# Altium project DE-150824.PrjPcb
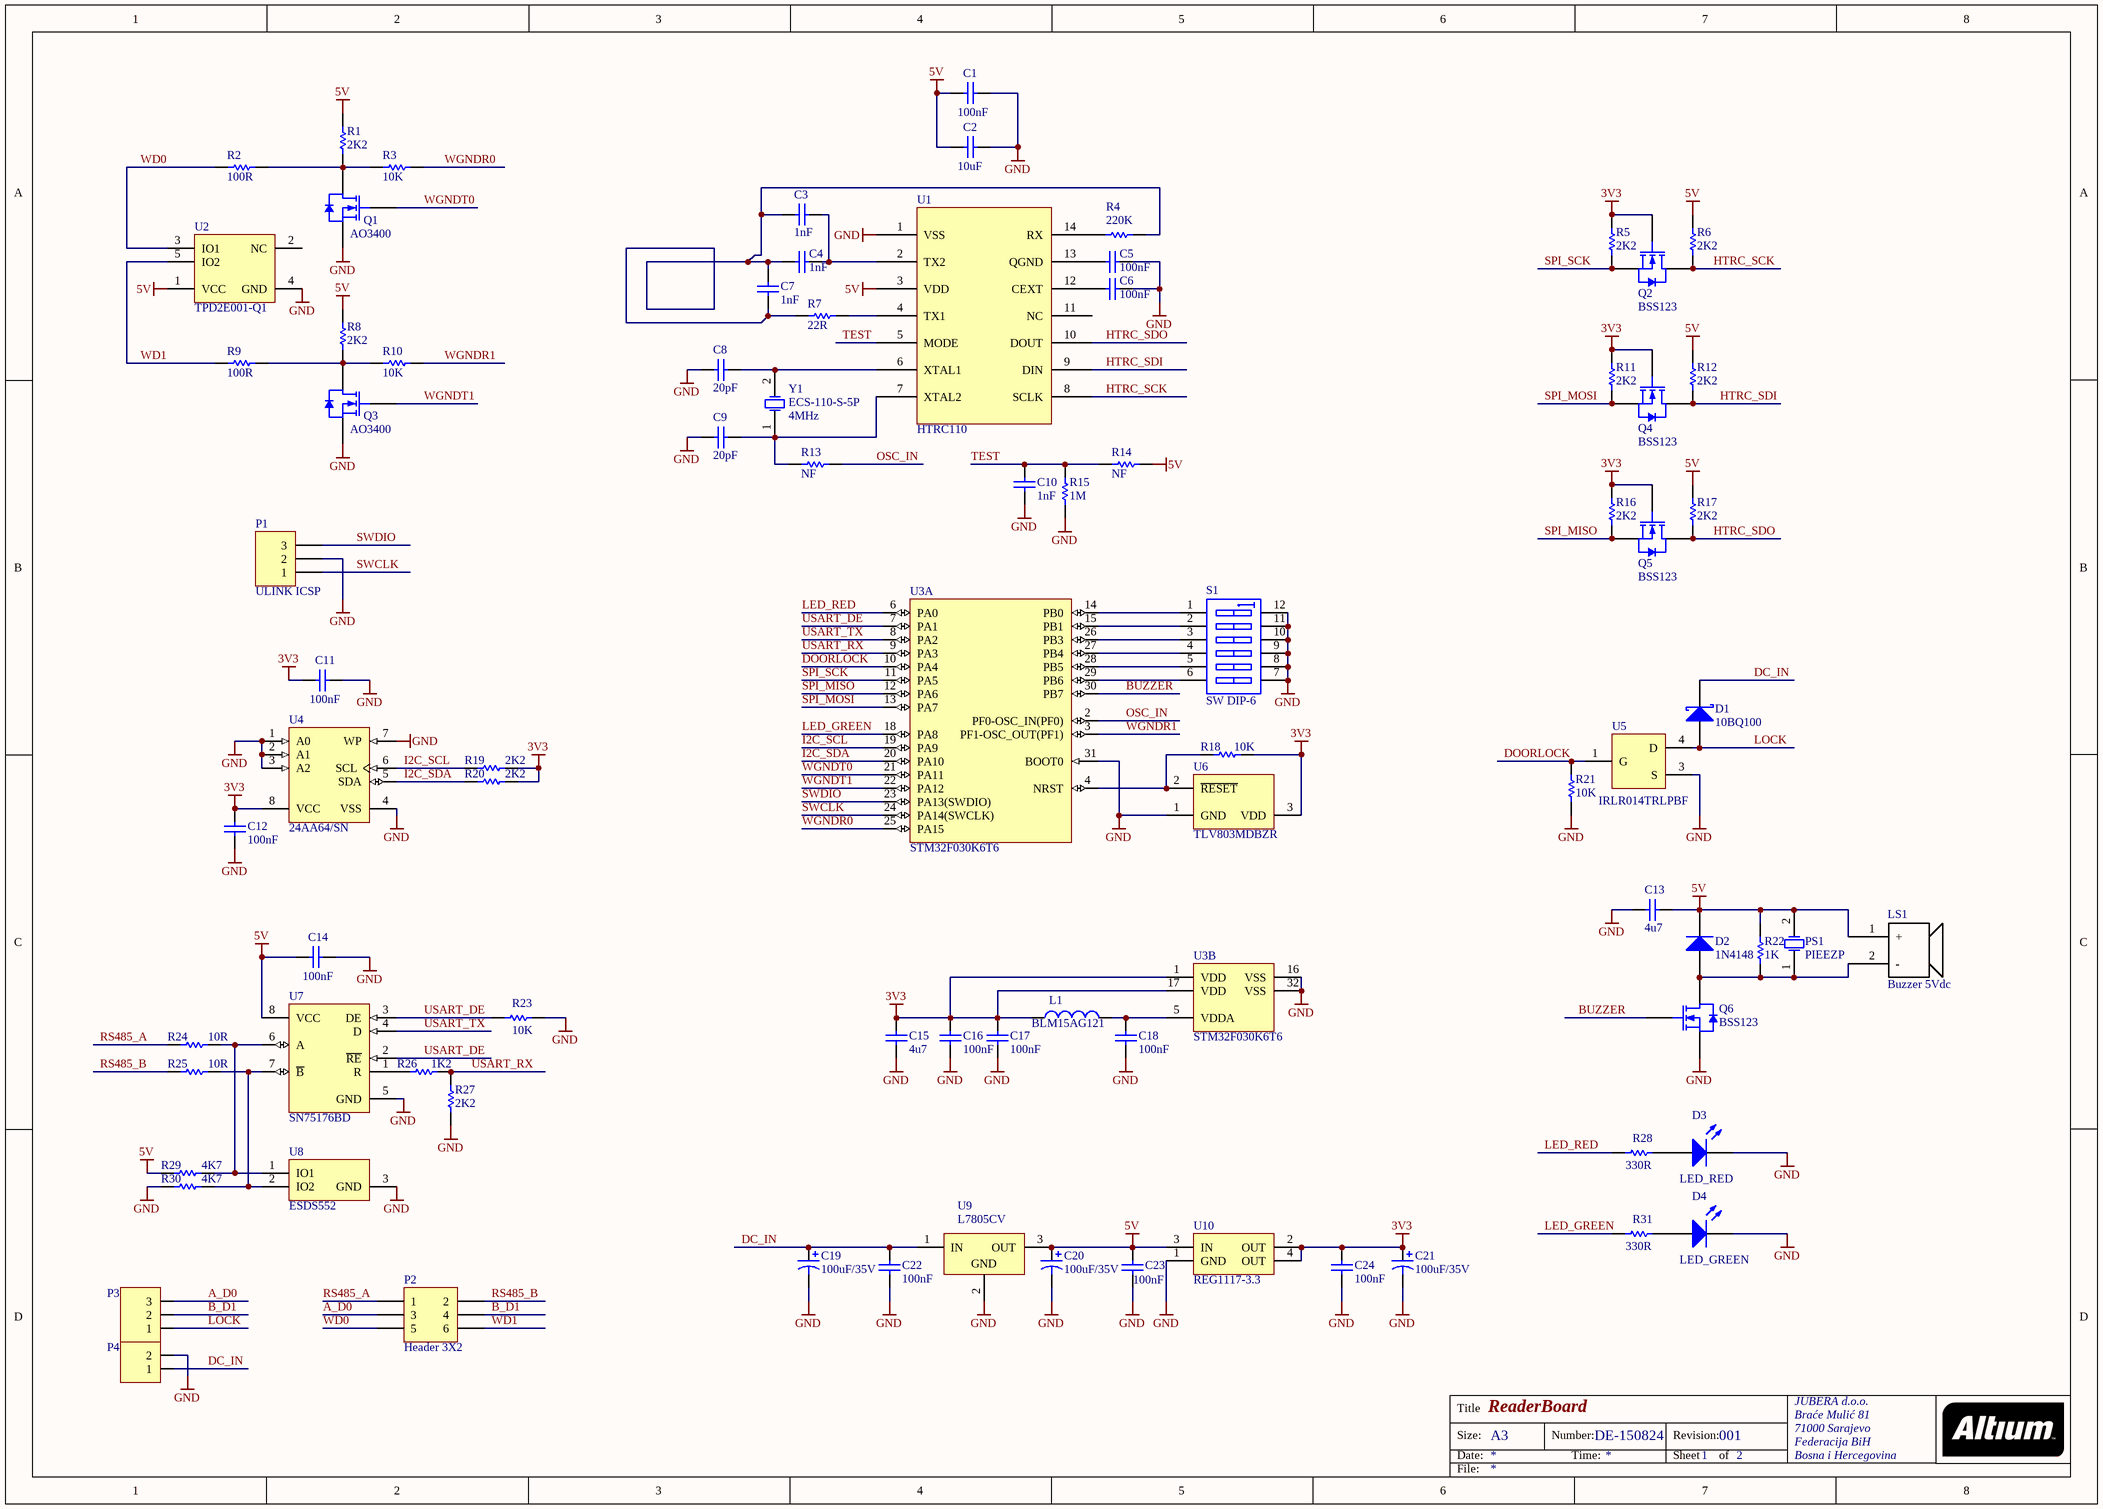
[diagram p0: DE-150824.SchDoc]
1 sheet, 84 parts. Net scope: global (net labels, ports and power ports of the same name join across sheets).
Board file: DE-150824.PcbDoc

## Sheet DE-150824.SchDoc: ReaderBoard
size A3; Author: eldar6776@hotmail.com; DrawnBy: Eldar Dedic; Organization: JUBERA d.o.o.; Address1: Braće Mulić 81; Address2: 71000 Sarajevo; Address3: Federacija BiH; Address4: Bosna i Hercegovina; DocumentNumber: DE-150824; Revision: 001; SheetNumber: 1; SheetTotal: 2

### Parts
C1  value 100nF  [0603]  (hidden comment: C0603)
C2  value 10uF  [0805]  (hidden comment: C0805)
C3  1nF  [VP31-2.5]
C4  value 1nF  [0805]  (hidden comment: C0805)
C5  value 100nF  [0603]  (hidden comment: C0603)
C6  value 100nF  [0603]  (hidden comment: C0603)
C7  value 1nF  [0805]  (hidden comment: C0805)
C8  20pF  [0603]
C9  20pF  [0603]
C10  value 1nF  [0603]  (hidden comment: C0603)
C11  value 100nF  [0603]  (hidden comment: C0603)
C12  value 100nF  [0603]  (hidden comment: C0603)
C13  value 4u7  [0805]  (hidden comment: C0805)
C14  value 100nF  [0603]  (hidden comment: C0603)
C15  value 4u7  [0805]  (hidden comment: C0805)
C16  value 100nF  [0603]  (hidden comment: C0603)
C17  value 100nF  [0603]  (hidden comment: C0603)
C18  value 100nF  [0603]  (hidden comment: C0603)
C19  100uF/35V  [F]
C20  100uF/35V  [F]
C21  100uF/35V  [F]
C22  value 100nF  [0603]  (hidden comment: C0603)
C23  value 100nF  [0603]  (hidden comment: C0603)
C24  value 100nF  [0603]  (hidden comment: C0603)
D1  10BQ100  [SMB]
D2  1N4148  [SOD323]
D3  LED_RED  [1.6X0.8X0.8]
D4  LED_GREEN  [1.6X0.8X0.8]
L1  BLM15AG121  [0402-A]
LS1  Buzzer 5Vdc  [BUZZER]
P1  ULINK ICSP  [HDR1X3]
P2  Header 3X2  [HDR2X3]
P3  3 pin terminal  [3 PIN TERMINAL BLOCK  3,5mm]  (value not drawn)
P4  2 pin terminal  [2 PIN TERMINAL BLOCK 3,5mm]  (value not drawn)
PS1  PIEEZP  [PKM13EPYH4000-A0]
Q1  AO3400  [SOT23_N]
Q2  BSS123  [SOT23_N]
Q3  AO3400  [SOT23_N]
Q4  BSS123  [SOT23_N]
Q5  BSS123  [SOT23_N]
Q6  BSS123  [SOT23_N]
R1  2K2  [ERA-0805]
R2  100R  [ERA-0805]
R3  10K  [ERA-0805]
R4  220K  [ERA-0805]
R5  2K2  [ERA-0603]
R6  2K2  [ERA-0603]
R7  22R  [ERA-0805]
R8  2K2  [ERA-0805]
R9  100R  [ERA-0805]
R10  10K  [ERA-0805]
R11  2K2  [ERA-0603]
R12  2K2  [ERA-0603]
R13  NF  [ERA-0805]
R14  NF  [ERA-0805]
R15  1M  [ERA-0805]
R16  2K2  [ERA-0603]
R17  2K2  [ERA-0603]
R18  10K  [ERA-0603]
R19  2K2  [ERA-0603]
R20  2K2  [ERA-0603]
R21  10K  [ERA-0603]
R22  1K  [ERA-0603]
R23  10K  [ERA-0603]
R24  10R  [ERA-0805]
R25  10R  [ERA-0805]
R26  1K2  [ERA-0603]
R27  2K2  [ERA-0603]
R28  330R  [ERA-0603]
R29  4K7  [ERA-0603]
R30  4K7  [ERA-0603]
R31  330R  [ERA-0603]
S1  SW DIP-6  [DIP-12/SW]
U1  HTRC110  [SOIC-SL14_N]
U2  TPD2E001-Q1  [DRL5_V]
U3  STM32F030K6T6  [STM-LQFP32_N]  (parts A,B of 2)
U4  24AA64/SN  [SOIC-SN8_N]
U5  IRLR014TRLPBF  [ONSC-DPAK-3-369C-01_V]
U6  TLV803MDBZR  [DBZ3_N]
U7  SN75176BD  [D008_N]
U8  ESDS552  [DCK3_N]
U9  L7805CV  [TO220]
U10  REG1117-3.3  [ZZ311]
Y1  ECS-110-S-5P  value 4MHz  [CSM-7]

### Nets
3V3: C11.2 C12.2 C15.2 C16.2 C17.2 C21.1 C24.2 L1.1 Q2.1(G) Q4.1(G) Q5.1(G) R5.2 R11.2 R16.2 R18.1 R19.2 R20.2 U3.1(VDD) U3.17(VDD) U4.8(VCC) U6.3(VDD) U10.2(OUT) U10.4(OUT)
5V: C1.2 C2.2 C13.1 C14.2 C20.1 C23.2 D2.1(K) LS1.1(+) PS1.2(OSC2) R1.2 R6.2 R8.2 R12.2 R14.2 R17.2 R22.1 R29.1 U1.3(VDD) U2.1(VCC) U7.8(VCC) U9.3(OUT) U10.3(IN)
GND: C1.1 C2.1 C5.1 C6.1 C8.1 C9.1 C10.2 C11.1 C12.1 C13.2 C14.1 C15.1 C16.1 C17.1 C18.1 C19.2 C20.2 C21.2 C22.1 C23.1 C24.1 D3.2(K) D4.2(K) P1.2 P4.2 Q1.2(S) Q3.2(S) Q6.2(S) R15.1 R21.2 R23.2 R27.1 R30.1 S1.7(B6) S1.8(B5) S1.9(B4) S1.10(B3) S1.11(B2) S1.12(B1) U1.1(VSS) U2.4(GND) U3.16(VSS) U3.31(BOOT0) U3.32(VSS) U4.1(A0) U4.2(A1) U4.3(A2) U4.4(VSS) U4.7(WP) U5.3(S) U6.1(GND) U7.5(GND) U8.3(GND) U9.2(GND) U10.1(GND)
A_D0: P2.3 P3.3
B_D1: P2.4 P3.2
BUZZER: Q6.1(G) U3.30(PB7)
DC_IN: C19.1 C22.2 D1.2(K) P4.1 U9.1(IN)
DOORLOCK: R21.1 U3.10(PA4) U5.1(G)
HTRC_SCK: Q2.3(D) R6.1 U1.8(SCLK)
HTRC_SDI: Q4.3(D) R12.1 U1.9(DIN)
HTRC_SDO: Q5.3(D) R17.1 U1.10(DOUT)
I2C_SCL: R19.1 U3.19(PA9) U4.6(SCL)
I2C_SDA: R20.1 U3.20(PA10) U4.5(SDA)
LED_GREEN: R31.1 U3.18(PA8)
LED_RED: R28.1 U3.6(PA0)
LOCK: D1.1(A) P3.1 U5.4(D)
OSC_IN: R13.2 U3.2(PF0-OSC_IN(PF0))
RS485_A: P2.1 R24.1
RS485_B: P2.2 R25.1
SPI_MISO: Q5.2(S) R16.1 U3.12(PA6)
SPI_MOSI: Q4.2(S) R11.1 U3.13(PA7)
SPI_SCK: Q2.2(S) R5.1 U3.11(PA5)
SWCLK: P1.1 U3.24(PA14(SWCLK))
SWDIO: P1.3 U3.23(PA13(SWDIO))
TEST: C10.1 R14.1 R15.2 U1.5(MODE)
USART_DE: R23.1 U3.7(PA1) U7.2(~{RE}) U7.3(DE)
USART_RX: R26.2 R27.2 U3.9(PA3)
USART_TX: U3.8(PA2) U7.4(D)
WD0: P2.5 R2.2 U2.3(IO1)
WD1: P2.6 R9.2 U2.5(IO2)
WGNDR0: R3.1 U3.25(PA15)
WGNDR1: R10.1 U3.3(PF1-OSC_OUT(PF1))
WGNDT0: Q1.1(G) U3.21(PA11)
WGNDT1: Q3.1(G) U3.22(PA12)
NetC3_1: C3.1 C4.2 C7.1 C7.2 R4.2 R7.1
NetC3_2: C3.2 C4.1 U1.2(TX2)
NetC5_2: C5.2 U1.13(QGND)
NetC6_2: C6.2 U1.12(CEXT)
NetC8_2: C8.2 U1.6(XTAL1) Y1.2(OSC2)
NetC9_2: C9.2 R13.1 U1.7(XTAL2) Y1.1(OSC1)
NetC18_2: C18.2 L1.2 U3.5(VDDA)
NetD2_2: D2.2(A) LS1.2(-) PS1.1(OSC1) Q6.3(D) R22.2
NetD3_1: D3.1(A) R28.2
NetD4_1: D4.1(A) R31.2
NetQ1_3: Q1.3(D) R1.1 R2.1 R3.2
NetQ3_3: Q3.3(D) R8.1 R9.1 R10.2
NetR4_1: R4.1 U1.14(RX)
NetR7_2: R7.2 U1.4(TX1)
NetR18_2: R18.2 U3.4(NRST) U6.2(~{RESET})
NetR24_2: R24.2 R29.2 U7.6(A) U8.1(IO1)
NetR25_2: R25.2 R30.2 U7.7(~{B}) U8.2(IO2)
NetR26_1: R26.1 U7.1(R)
NetS1_1: S1.1(A1) U3.14(PB0)
NetS1_2: S1.2(A2) U3.15(PB1)
NetS1_3: S1.3(A3) U3.26(PB3)
NetS1_4: S1.4(A4) U3.27(PB4)
NetS1_5: S1.5(A5) U3.28(PB5)
NetS1_6: S1.6(A6) U3.29(PB6)

Not connected (* = marked no-connect by the designer): U1 11(NC); U2 2(NC)

### Notes on the sheet
- Title
- Size:
- Date:
- A3
- Number:
- Time:
- Revision:
- Sheet
- of
- File:

### Library data of the parts
C1 C5 C6 C8-C12 C14 C16-C18 C22-C24 = C0603: Ceramic Chip Capacitor - Standard; Note: Footprint corresponds to dimensions for bulk cassette packaging. This case size has tightened tolerances.; Published: 17-Jul-2002; LatestRevisionDate: 19-Mar-2004; LatestRevisionNote: Silkscreen size reduced.; DatasheetDocument: Mar-2001; PackageDocument: Mar-2001; PackageReference: 0603; Publisher: Altium Limited; Code_JEITA: 0603; Code_IPC: 1608 [0603]; ComponentLink1Description: Manufacturer Link; ComponentLink1URL: http://www.kemet.com/; ComponentLink2Description: Datasheet; ComponentLink2URL: http://www.kemet.com/kemet/web/homepage/kechome.nsf/vapubfilesname/F3102TA.pdf/$file/F3102TA.pdf
  C8 C9: Value: 20pF
C2 C4 C7 C13 C15 = C0805: Ceramic Chip Capacitor - Standard; Note: Footprint corresponds to dimensions for bulk cassette packaging. This case size has tightened tolerances.; Published: 17-Jul-2002; LatestRevisionDate: 19-Mar-2004; LatestRevisionNote: Silkscreen size reduced.; DatasheetDocument: Mar-2001; PackageDocument: Mar-2001; PackageReference: 0805; Publisher: Altium Limited; Code_JEITA: 0805; Code_IPC: 2012[0805]; ComponentLink1Description: Manufacturer Link; ComponentLink1URL: http://www.kemet.com/; ComponentLink2Description: Datasheet; ComponentLink2URL: http://www.kemet.com/kemet/web/homepage/kechome.nsf/vapubfilesname/F3102TA.pdf/$file/F3102TA.pdf
C3 = VP31BA1R0CA: Dipped Radial Multilayer Ceramic Capacitor COG (NPO): 1pF, 50/63V; Note: See Datasheet for other packages & tolerances; Published: 17-Dec-2003; DatasheetDocument: 2-Jan-2002; PackageDocument: 8-Feb-2002; PackageReference: VP31-2.5; Publisher: Altium Limited; ComponentLink1Description: Manufacturer Link; ComponentLink1URL: http://www.vishay.com/; Value: 1pF
C19-C21 = 194D106X0015F2: Midget Conformal Coated Solid Tantalum Chip Capacitor: 10uF, 20% Tolerance, 15 WVDC @ +85°C, Surge = 20V; Note: See Data Sheet for full range of components; Published: 19-Mar-2004; DatasheetDocument: 05-Jul-2002; PackageReference: F; Publisher: Altium Limited; ComponentLink1Description: Manufacturer Link; ComponentLink1URL: http://www.vishay.com/; ComponentLink2Description: Datasheet; ComponentLink2URL: http://www.vishay.com/docs/40000/194d.pdf; Value: 10uF
D1 = 10BQ100: Schottky Rectifier; Published: 8-Jun-2000; LatestRevisionDate: 17-Jul-2002; LatestRevisionNote: Re-released for DXP Platform.; DatasheetVersion: PD-2.437A; PackageReference: SMB; Publisher: Altium Limited; PackageDescription: DO-214-AA/SMB; 2 C-Bend Leads; Body 5.3 x 3.6 mm, inc. leads (LxW); ComponentLink1Description: Manufacturer Link; ComponentLink1URL: http://www.irf.com/; ComponentLink2Description: Datasheet; ComponentLink2URL: http://www.irf.com/product-info/datasheets/data/10bq100.pdf
D2 = BAS321: General-purpose Diode; Published: 17-Sep-2003; LatestRevisionDate: 19-Mar-2004; LatestRevisionNote: Silkscreen size reduced.; DatasheetVersion: 9-Feb-1999; PackageVersion: May-1999; PackageReference: SOD323; Publisher: Altium Limited; PackageDescription: SOD-323/SC-76; 2 Leads; Body 1.7 x 1.3 mm, (LxW); ComponentLink1Description: Manufacturer Link; ComponentLink1URL: http://www.semiconductors.philips.com/; ComponentLink2Description: Datasheet; ComponentLink2URL: http://www.semiconductors.philips.com/acrobat/datasheets/BAS321_2.pdf
D3 D4 = HSMB-C190: Blue Surface Mount Chip LED, Blue; LuminousIntensity: 1.6mcd (Minimum).; PCB_Layout: Complies with manufacturer's recommendation.; Published: 11-Dec-2002; DatasheetVersion: 26-Feb-2002; PackageVersion: Mar-2002; PackageReference: 1.6X0.8X0.8; Publisher: Altium Limited; PackageDescription: SM LED; 2 Flat Leads; LED_Colour: Blue; ComponentLink1Description: Manufacturer Link; ComponentLink1URL: http://www.avagotech.com/; ComponentLink2Description: Datasheet; ComponentLink2URL: http://cp.literature.agilent.com/litweb/pdf/5988-5211EN.pdf
L1 = Chip inductor: SMD chip inductor; Code_IEC: 1005; Published: 8-Jun-2000; LatestRevisionDate: 29-May-2009; LatestRevisionNote: IPC-7351 Footprint Added.; PackageReference: 0402-A; Publisher: Altium Limited; PackageDescription: Chip Inductor; Code_JEITA: 0402
LS1 = BUZZER: 5Vdc PCB buzzer
P1 = Header 3: Header, 3-Pin; LatestRevisionDate: 17-Jul-2002; LatestRevisionNote: Re-released for DXP Platform.; Publisher: Altium Limited
P2 = Header 3X2: Header, 3-Pin, Dual row; LatestRevisionDate: 17-Jul-2002; LatestRevisionNote: Re-released for DXP Platform.; Publisher: Altium Limited
P3 = TERMINAL BLOK 3: 3 pinski terminal blok konektor
P4 = TERMINAL BLOK 2: Terminal blok konektor 3,5 mm
PS1 = PKM13EPYH4000-A0: Surface Mount Quartz Crystal; Note: PCB layout complies with manufacturer's recommendation.; Published: 17-Jul-2002; DatasheetDocument: 18-Oct-1999; PackageDocument: 18-Oct-1999; PackageReference: HC49/4H_SMX; Publisher: Altium Limited; ComponentLink1Description: Manufacturer Link; ComponentLink1URL: http://www.cmac.com/mt/; ComponentLink2Description: Datasheet; ComponentLink2URL: http://www.cmac.com/mt/databook/crystals/smd/hc49_4h_smx.pdf
Q1-Q6 = BSS123: N-channel Enhancement Mode Vertical D-MOSFET; Published: 17-Sep-2003; LatestRevisionDate: 12-Dec-2006; LatestRevisionNote: IPC-7351 Footprint Added.; DatasheetVersion: Apr-1995; PackageVersion: May-1999; PackageReference: SOT23; Publisher: Altium Limited; PackageDescription: 3-Pin SOT-23 Package 0.95 mm Pitch, 2.3 mm Lead Span; ComponentLink1Description: Manufacturer Link; ComponentLink1URL: http://www.semiconductors.philips.com/; ComponentLink2Description: Datasheet; ComponentLink2URL: http://www.semiconductors.philips.com/acrobat/datasheets/BSS123_3.pdf
R1-R4 R7-R10 R13-R15 R24 R25 = ERAS: Metal Film Thermosensitive Chip Resistor, 0.56 Ohm to 10k Ohm Range, 5% Tolerance, 0805 Size, 0.1 W; Note: If flow soldering, adjust pad width of PCB Footprint to 0.7 - 0.8 times the width of the resistor.; Published: 17-Dec-2003; LatestRevisionDate: 19-Mar-2004; LatestRevisionNote: Silkscreen size reduced.; PackageDocument: Mar-2003; PackageReference: ERA-0805; Publisher: Altium Limited; Code_IPC: 2012 [0805]; ComponentLink1Description: Manufacturer Link; ComponentLink1URL: http://www.panasonic.com/industrial/components/resistive_products.htm; ComponentLink2Description: Datasheet; ComponentLink2URL: http://www.panasonic.com/industrial/components/pdf/AOF0000CE1.pdf
R5 R6 R11 R12 R16-R23 R26-R31 = ERAV: Metal Film Thermosensitive Chip Resistor, 0.56 Ohm to 10k Ohm Range, 5% Tolerance, 0603 Size, 0.063 W; Note: If flow soldering, adjust pad width of PCB Footprint to 0.7 - 0.8 times the width of the resistor.; Published: 17-Dec-2003; LatestRevisionDate: 19-Mar-2004; LatestRevisionNote: Silkscreen size reduced.; PackageDocument: Mar-2003; PackageReference: ERA-0603; Publisher: Altium Limited; Code_IPC: 1608 [0603]; ComponentLink1Description: Manufacturer Link; ComponentLink1URL: http://www.panasonic.com/industrial/components/resistive_products.htm; ComponentLink2Description: Datasheet; ComponentLink2URL: http://www.panasonic.com/industrial/components/pdf/AOF0000CE1.pdf
S1 = SW DIP-6: DIP Switch, 6 Position, SPST; Published: 24-Mar-1999; LatestRevisionDate: 17-Jul-2002; LatestRevisionNote: Re-released for DXP Platform.; PackageReference: DIP-12/SW; Publisher: Altium Limited; PackageDescription: DIP Switch; 12 Leads
U1 = HTRC110: HITAG reader chip
U2 = TPD2E001IDRLRQ1: Automotive Catalog Low-Capacitance + / - 15 kV ESD-Protection Array for High-Speed Data Inter, 2 Channels, -40 to +85 degC, 5-pin SOT (DRL), Green (RoHS & no Sb/Br); Manufacturer: Texas Instruments; Breakdown Voltage(Min)(V): 11; IEC 61000-4-2 Air-Gap(+/- kV): 15; IEC 61000-4-2 Contact(+/- kV): 8; IO Capacitance(Typ)(pF): 1.5; IO Leakage Current(nA): 1; SubFamily: ESD Solution; USB High Speed: TRUE; DatasheetVersion: SLLS993; PackageVersion: revD, Aug-2007; PackageReference: DRL5; PackageDescription: 5-Pin Plastic Small Outline, Flat Lead 0.5 mm Pitch; Supplier 1: Digi-Key; Supplier Part Number 1: 296-29985-2-ND; Supplier 2: Digi-Key; Supplier Part Number 2: 296-29985-1-ND; Supplier 3: Digi-Key; Supplier Part Number 3: 296-29985-6-ND; Supplier 4: Newark; Supplier Part Number 4: 55R7553; Supplier 5: Mouser; Supplier Part Number 5: 595-TPD2E001IDRLRQ1; Eco-Plan: Green (RoHS & no Sb/Br); Mounting Technology: Surface Mount; PartNumber: TPD2E001IDRLRQ1; ComponentLink1Description: Datasheet; ComponentLink1URL: http://www.ti.com/general/docs/lit/getliterature.tsp?genericPartNumber=TPD2E001-Q1&fileType=pdf; ComponentLink2Description: URL Link1; ComponentLink2URL: SamplesURL:http://www.ti.com/product/tpd2e001-q1#samples
U3 = STM32F030K6T6: ARM Cortex-M0 32-bit MCU, 32 KB Flash, 4 KB Internal RAM, 26 I/Os, 32-pin LQFP, -40 to 85 degC, Tray; FLASH Size (Prog) (kB): 32; I/Os (High Current): 26; Internal RAM Size (kB): 4; Operating Frequency(F) (Processor speed) (MHz): 48; Supply Voltage(Vcc) min (V): 2.4; DatasheetVersion: Rev. 1; PackageVersion: Rev. 1, 07/2013; PackageReference: LQFP32; PackageDescription: 32-Pin Low Profile Quad Flat Package, 7 x 7 mm Body, 0.8 mm Pitch; Supplier 1: Digi-Key; Supplier Part Number 1: 497-14046-ND; Supplier 2: Newark; Supplier Part Number 2: 19X6194; Supplier 3: Mouser; Supplier Part Number 3: 511-STM32F030K6T6; Core: ARM Cortex-M0; Packing: Tray; Mounting Technology: Surface Mount; PartNumber: STM32F030K6T6; ComponentLink1Description: Manufacturer URL; ComponentLink1URL: http://www.st.com/web/en/home.html; ComponentLink2Description: Datasheet; ComponentLink2URL: http://www.st.com/st-web-ui/static/active/en/resource/technical/document/datasheet/DM00088500.pdf; ComponentLink3Description: Package Specification; ComponentLink3URL: http://www.st.com/st-web-ui/static/active/en/resource/technical/document/datasheet/DM00088500.pdf
U4 = 24AA64/SN: 64Kbit, 400kHz, 1.7V, I2C Serial EEPROM, 8-Pin SOIC 150mil, Commercial Temperature; Published: 29-Jan-2009; DatasheetVersion: revQ, Jun-2009; PackageVersion: revBB, Aug-2009; PackageReference: SOIC-SN8; Publisher: Altium Limited; PackageDescription: 8-Lead Plastic Small Outline (SN) - Narrow, 3.90mm Body [SOIC]; Supplier 1: Digi-Key; Supplier Part Number 1: 24AA64/SN-ND; Code_JEDEC: MS-012; Code_IPC: SOIC127P600-8; ComponentLink1Description: Datasheet; ComponentLink1URL: http://ww1.microchip.com/downloads/en/DeviceDoc/21189Q.pdf; ComponentLink2Description: Packaging Specification; ComponentLink2URL: http://www.microchip.com/stellent/groups/techpub_sg/documents/packagingspec/en012702.pdf; ComponentLink3Description: Microchip.com Home; ComponentLink3URL: http://www.microchip.com/
U5 = NCV8408DTRKG: Self-Protected Low Side Driver with Temperature and Current Limit, 42 V, 10 A, Single N-Channel, 3-Pin DPAK, Pb-Free, Tape and Reel; Manufacturer: On Semiconductor; Channel Polarity: N Channel; DatasheetVersion: Rev. 2; PackageVersion: Rev. E, 02/2014; PackageReference: DPAK-3-369C-01; PackageDescription: 3-Pin Flange Mount, Body 6.54 x 6.095 mm, Pitch 2.29 mm; Supplier 1: Newark; Supplier Part Number 1: 60W1739; Supplier 2: Mouser; Supplier Part Number 2: 863-NCV8408DTRKG; Packing: Tape and Reel; RoHS: Pb-Free; Mounting Technology: Surface Mount; PartNumber: NCV8408DTRKG; ComponentLink1Description: Manufacturer URL; ComponentLink1URL: http://www.onsemi.com/; ComponentLink2Description: Datasheet; ComponentLink2URL: http://www.onsemi.com/pub_link/Collateral/NCV8408-D.PDF; ComponentLink3Description: Package Specification; ComponentLink3URL: http://www.onsemi.cn/pub_link/Collateral/369C.PDF
U6 = TLV803MDBZR: Voltage Supervisor with Active-Low, Open Drain Reset, 1 Supply Monitored, -40 to 125 degC, 3-pin SOT-23 (DBZ), Green (RoHS & no Sb/Br); Manufacturer: Texas Instruments; # of supplies monitored: 1; Iq(Typ)(uA): 9; Output Driver Type / Reset Output: Active-low, Open-drain; Rating: Catalog; Reset Threshold Accuracy(%): 2; SubFamily: Supervisor and Reset IC; Threshold Voltage 1 (typ)(Typ)(V): 4.38; Time Delay(ms): 200; VCC(Max)(V): 6; VCC(Min)(V): 1.1; DatasheetVersion: SBVS157B; PackageVersion: revB, Apr-2005; PackageReference: DBZ3; PackageDescription: 3-Pin Plastic Small-Outline Package, 0.95 mm Pitch, 2.4 mm Lead Span; Supplier 1: Digi-Key; Supplier Part Number 1: 296-29194-2-ND; Supplier 2: Digi-Key; Supplier Part Number 2: 296-29194-1-ND; Supplier 3: Digi-Key; Supplier Part Number 3: 296-29194-6-ND; Supplier 4: Newark; Supplier Part Number 4: 58T0286; Supplier 5: Mouser; Supplier Part Number 5: 595-TLV803MDBZR; Mounting Technology: Surface Mount; Code_JEDEC: TO-236-AB; PartNumber: TLV803MDBZR; ComponentLink1Description: Datasheet; ComponentLink1URL: http://www.ti.com/general/docs/lit/getliterature.tsp?genericPartNumber=TLV803M&fileType=pdf
U7 = SN75176BD: Differential Bus Transceiver; Note: Receiver Hysteresis of 50mV Typical; Published: 15-May-2002; LatestRevisionDate: 13-Apr-2006; LatestRevisionNote: IPC-7351 Footprint Added.; DatasheetVersion: Sep-1989; PackageVersion: Jan-1998; PackageReference: D008; Publisher: Altium Limited; PackageDescription: 8-Pin Small Outline Integrated Circuit 1.27 mm Pitch; Code_IPC: SOIC127P600-8; ComponentLink1Description: Manufacturer Link; ComponentLink1URL: http://www.ti.com/; ComponentLink2Description: Datasheet; ComponentLink2URL: http://www-s.ti.com/sc/ds/sn75176b.pdf
U8 = TPD2E007DCKR: ESD Protection Array for AC Signal Data Interface, 2 Channels, -40 to +85 degC, 3-pin SC70 (DCK), Green (RoHS & no Sb/Br); Manufacturer: Texas Instruments; Breakdown Voltage(Min)(V): +/-14; IEC 61000-4-2 Air-Gap(+/- kV): 15; IEC 61000-4-2 Contact(+/- kV): 8; IO Leakage Current(nA): 50; SubFamily: ESD Solution; DatasheetVersion: SLVS796E; PackageVersion: revG, Jan-2007; PackageReference: DCK3; PackageDescription: 3-Pin Plastic Small-Outline Package, 0.65 mm Pitch, 2.1 mm Lead Span; Supplier 1: Digi-Key; Supplier Part Number 1: 296-25281-2-ND; Supplier 2: Digi-Key; Supplier Part Number 2: 296-25281-1-ND; Supplier 3: Digi-Key; Supplier Part Number 3: 296-25281-6-ND; Supplier 4: Farnell; Supplier Part Number 4: 2120465; Supplier 5: Newark; Supplier Part Number 5: 94T5089; Supplier 6: Newark; Supplier Part Number 6: 55R7554; Supplier 7: Mouser; Supplier Part Number 7: 595-TPD2E007DCKR; Eco-Plan: Green (RoHS & no Sb/Br); IO Capacitance(Typ)(pF): 15; Mounting Technology: Surface Mount; PartNumber: TPD2E007DCKR; ComponentLink1Description: Datasheet; ComponentLink1URL: http://www.ti.com/general/docs/lit/getliterature.tsp?genericPartNumber=TPD2E007&fileType=pdf; ComponentLink2Description: URL Link1; ComponentLink2URL: SamplesURL:http://www.ti.com/product/tpd2e007#samples
U9 = L7805CV: Positive Voltage Regulator, 5V, 3-Pin TO-220; DatasheetVersion: Nov-2011; PackageVersion: ver3.0; PackageReference: TO220; PackageDescription: TO, Thru-Hole, Vertical, Heatsink Mounted; 3 In-Line Leads; Pitch 2.54 mm; PartNumber: L7805CV; ComponentLink1Description: Manufacturer URL; ComponentLink1URL: http://www.st.com; ComponentLink2Description: Datasheet; ComponentLink2URL: http://www.st.com/internet/com/TECHNICAL_RESOURCES/TECHNICAL_LITERATURE/DATASHEET/CD00000444.pdf; ComponentLink3Description: Package Specification; ComponentLink3URL: http://www.st.com/internet/com/TECHNICAL_RESOURCES/TECHNICAL_LITERATURE/PACKAGE_INFORMATION/CD00004649.pdf
U10 = REG1117-3.3: 800mA and 1A Low Dropout Positive Regulator 2.85V, 3.3V, 5V, and Adjustable; Published: 8-Jun-2000; LatestRevisionDate: 17-Jul-2002; LatestRevisionNote: Re-released for DXP Platform.; DatasheetVersion: Sep-1997; PackageVersion: revC; PackageReference: ZZ311; Publisher: Altium Limited; PackageDescription: SOT-223/SC-73; 4 Leads; Body 6.7 x 7.3 mm, inc. leads (LxW max); ComponentLink1Description: Manufacturer Link; ComponentLink1URL: http://www.ti.com/; ComponentLink2Description: Datasheet; ComponentLink2URL: http://www-s.ti.com/sc/ds/REG1117.pdf
Y1 = ECS-110-S-5P: Crystal Oscillator; Published: 17-Jul-2002; DatasheetDocument: 18-Apr-2000; PackageReference: CSM-7; Publisher: Altium Limited; ComponentLink1Description: Manufacturer Link; ComponentLink1URL: http://www.ecsxtal.com/; ComponentLink2Description: Datasheet; ComponentLink2URL: http://www.ecsxtal.com/pdf3/CSM_7.pdf